# EAGLE design antares-O (EAGLE 4.16)
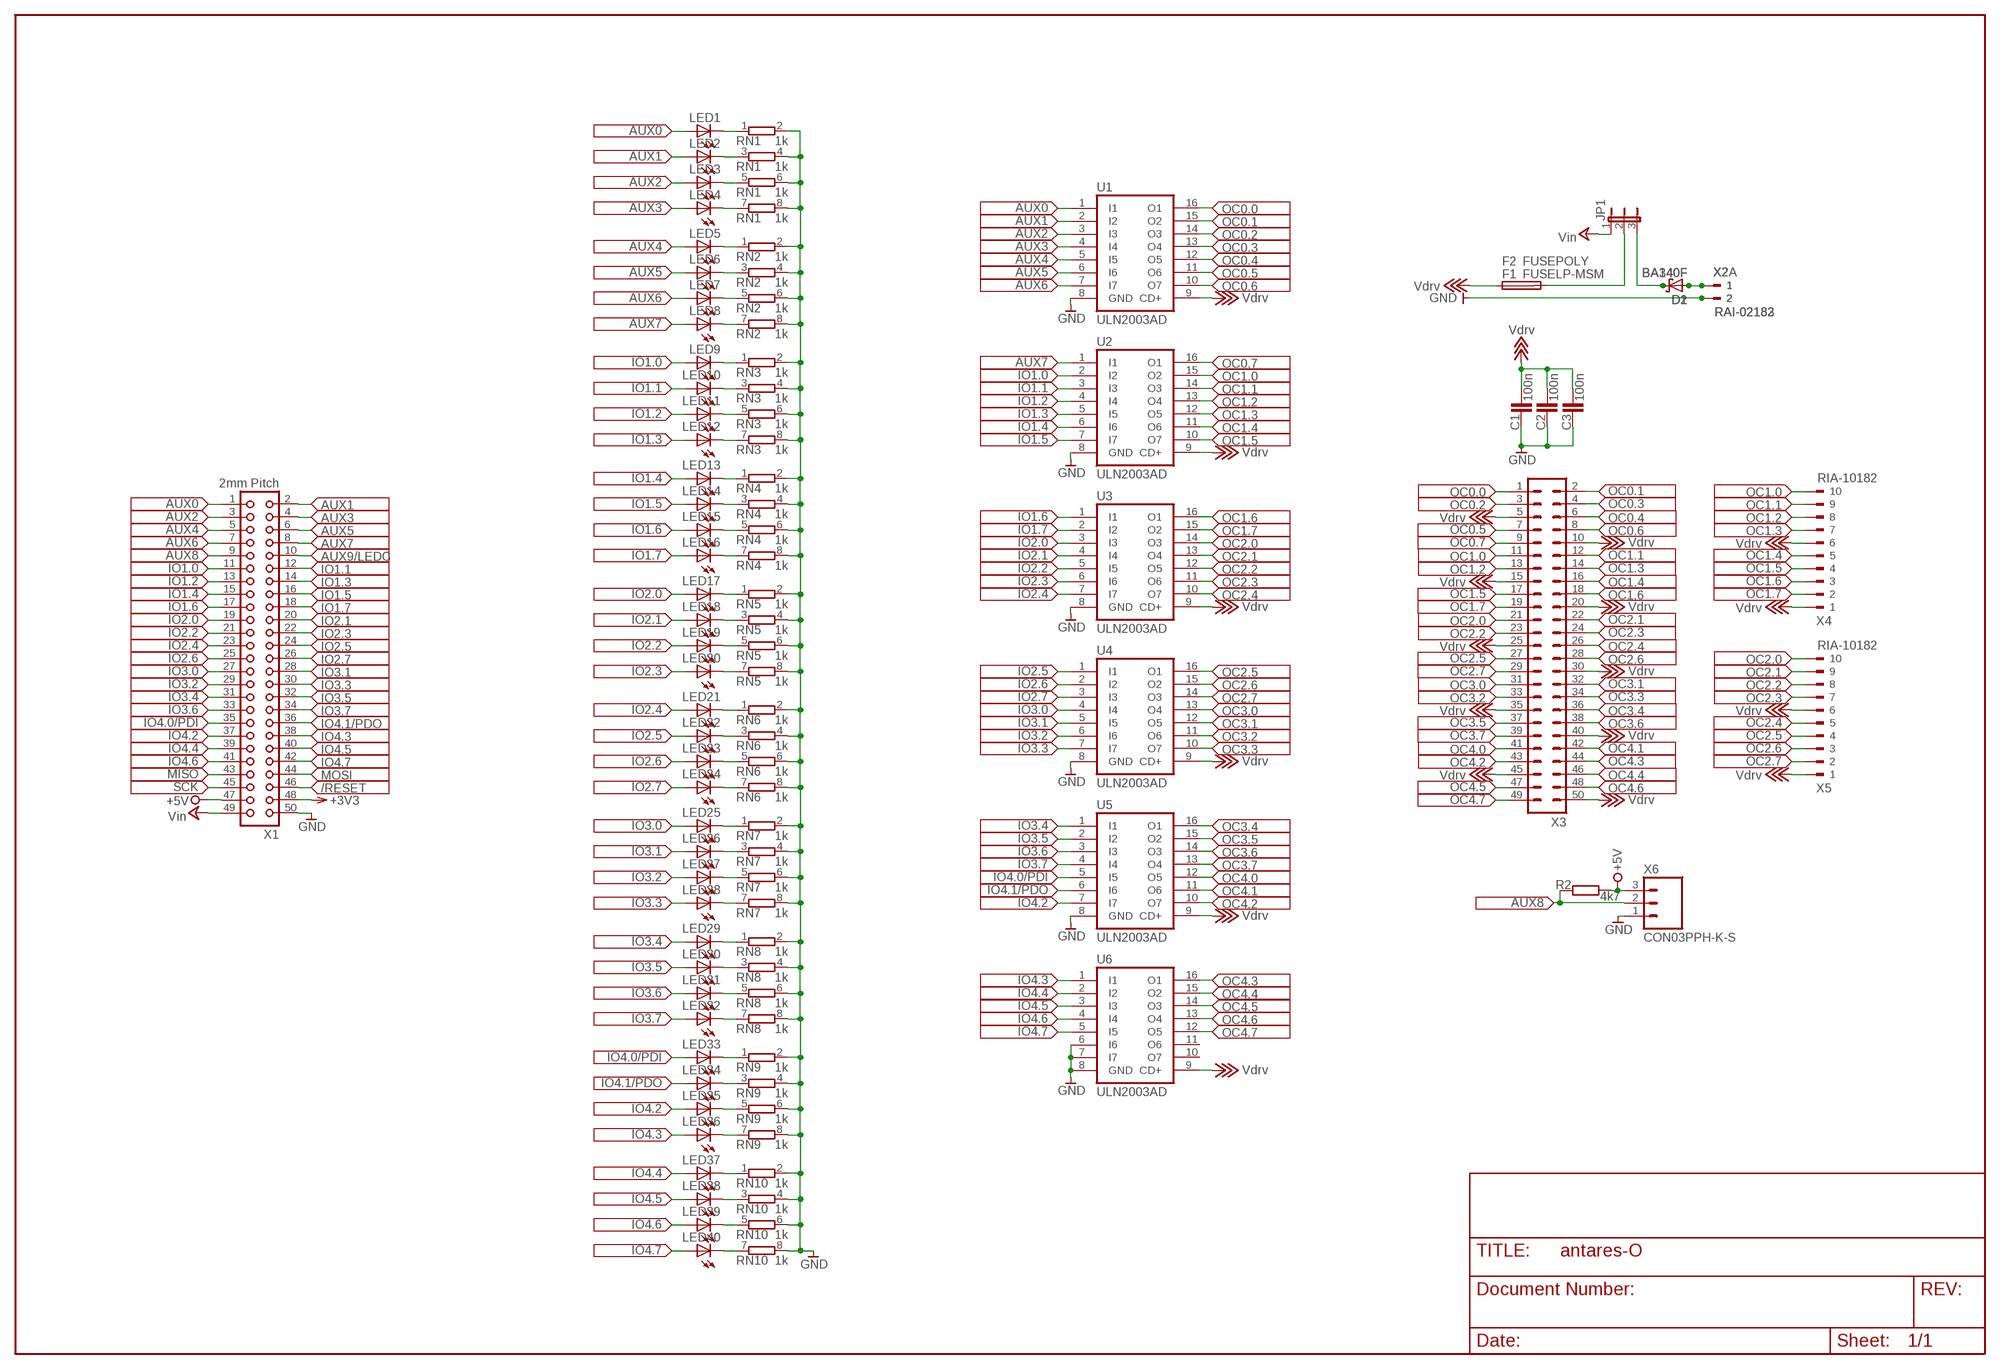
[diagram p0: schematic, sheet 1]

## Parts
C1  100n  C-EUC1206  [C1206]
C2  100n  C-EUC1206  [C1206]
C3  100n  C-EUC1206  [C1206]
D1  BA140F  SCHOTTKY-DIODESMC  [SMC]
D2  BA340F  SCHOTTKY-DIODESMA  [SMA]
F1  FUSELP-MSM  [LP-MSM]
F2  FUSEPOLY  [POLYFUSE]
JP1  JP2EI  [JP2]
LED1  LEDCHIP-LED0805  [CHIP-LED0805]
LED2  LEDCHIP-LED0805  [CHIP-LED0805]
LED3  LEDCHIP-LED0805  [CHIP-LED0805]
LED4  LEDCHIP-LED0805  [CHIP-LED0805]
LED5  LEDCHIP-LED0805  [CHIP-LED0805]
LED6  LEDCHIP-LED0805  [CHIP-LED0805]
LED7  LEDCHIP-LED0805  [CHIP-LED0805]
LED8  LEDCHIP-LED0805  [CHIP-LED0805]
LED9  LEDCHIP-LED0805  [CHIP-LED0805]
LED10  LEDCHIP-LED0805  [CHIP-LED0805]
LED11  LEDCHIP-LED0805  [CHIP-LED0805]
LED12  LEDCHIP-LED0805  [CHIP-LED0805]
LED13  LEDCHIP-LED0805  [CHIP-LED0805]
LED14  LEDCHIP-LED0805  [CHIP-LED0805]
LED15  LEDCHIP-LED0805  [CHIP-LED0805]
LED16  LEDCHIP-LED0805  [CHIP-LED0805]
LED17  LEDCHIP-LED0805  [CHIP-LED0805]
LED18  LEDCHIP-LED0805  [CHIP-LED0805]
LED19  LEDCHIP-LED0805  [CHIP-LED0805]
LED20  LEDCHIP-LED0805  [CHIP-LED0805]
LED21  LEDCHIP-LED0805  [CHIP-LED0805]
LED22  LEDCHIP-LED0805  [CHIP-LED0805]
LED23  LEDCHIP-LED0805  [CHIP-LED0805]
LED24  LEDCHIP-LED0805  [CHIP-LED0805]
LED25  LEDCHIP-LED0805  [CHIP-LED0805]
LED26  LEDCHIP-LED0805  [CHIP-LED0805]
LED27  LEDCHIP-LED0805  [CHIP-LED0805]
LED28  LEDCHIP-LED0805  [CHIP-LED0805]
LED29  LEDCHIP-LED0805  [CHIP-LED0805]
LED30  LEDCHIP-LED0805  [CHIP-LED0805]
LED31  LEDCHIP-LED0805  [CHIP-LED0805]
LED32  LEDCHIP-LED0805  [CHIP-LED0805]
LED33  LEDCHIP-LED0805  [CHIP-LED0805]
LED34  LEDCHIP-LED0805  [CHIP-LED0805]
LED35  LEDCHIP-LED0805  [CHIP-LED0805]
LED36  LEDCHIP-LED0805  [CHIP-LED0805]
LED37  LEDCHIP-LED0805  [CHIP-LED0805]
LED38  LEDCHIP-LED0805  [CHIP-LED0805]
LED39  LEDCHIP-LED0805  [CHIP-LED0805]
LED40  LEDCHIP-LED0805  [CHIP-LED0805]
R2  4k7  R-EU_R0603  [R0603]
RN1  1k  E4RP  [BCN16]
RN2  1k  E4RP  [BCN16]
RN3  1k  E4RP  [BCN16]
RN4  1k  E4RP  [BCN16]
RN5  1k  E4RP  [BCN16]
RN6  1k  E4RP  [BCN16]
RN7  1k  E4RP  [BCN16]
RN8  1k  E4RP  [BCN16]
RN9  1k  E4RP  [BCN16]
RN10  1k  E4RP  [BCN16]
U1  ULN2003AD  [SO16]
U2  ULN2003AD  [SO16]
U3  ULN2003AD  [SO16]
U4  ULN2003AD  [SO16]
U5  ULN2003AD  [SO16]
U6  ULN2003AD  [SO16]
X1  2mm Pitch  CON50M  [2MM-50DM]
X2  RAI-02182  [182-02]
X2A  RAI-02183  [183-02]
X3  ML50  [ML50]
X4  RIA-10182  [182-10]
X5  RIA-10182  [182-10]
X6  CON03PPH-K-S  [B3B-PH-K-S]

## Nets
+3V3: X1.48
+5V: R2.2 X1.47 X6.3
/RESET: X1.46
AUX0: LED1.A U1.1(I1) X1.1
AUX1: LED2.A U1.2(I2) X1.2
AUX2: LED3.A U1.3(I3) X1.3
AUX3: LED4.A U1.4(I4) X1.4
AUX4: LED5.A U1.5(I5) X1.5
AUX5: LED6.A U1.6(I6) X1.6
AUX6: LED7.A U1.7(I7) X1.7
AUX7: LED8.A U2.1(I1) X1.8
AUX8: R2.1 X1.9 X6.2
AUX9: X1.10
GND [gnd-vcc]: C1.1 C2.1 C3.1 RN1.2 RN1.4 RN1.6 RN1.8 RN2.2 RN2.4 RN2.6 RN2.8 RN3.2 RN3.4 RN3.6 RN3.8 RN4.2 RN4.4 RN4.6 RN4.8 RN5.2 RN5.4 RN5.6 RN5.8 RN6.2 RN6.4 RN6.6 RN6.8 RN7.2 RN7.4 RN7.6 RN7.8 RN8.2 RN8.4 RN8.6 RN8.8 RN9.2 RN9.4 RN9.6 RN9.8 RN10.2 RN10.4 RN10.6 RN10.8 U1.8(GND) U2.8(GND) U3.8(GND) U4.8(GND) U5.8(GND) U6.6(I6) U6.7(I7) U6.8(GND) X1.50 X2.2 X2A.2 X6.1
IO1.0: LED9.A U2.2(I2) X1.11
IO1.1: LED10.A U2.3(I3) X1.12
IO1.2: LED11.A U2.4(I4) X1.13
IO1.3: LED12.A U2.5(I5) X1.14
IO1.4: LED13.A U2.6(I6) X1.15
IO1.5: LED14.A U2.7(I7) X1.16
IO1.6: LED15.A U3.1(I1) X1.17
IO1.7: LED16.A U3.2(I2) X1.18
IO2.0: LED17.A U3.3(I3) X1.19
IO2.1: LED18.A U3.4(I4) X1.20
IO2.2: LED19.A U3.5(I5) X1.21
IO2.3: LED20.A U3.6(I6) X1.22
IO2.4: LED21.A U3.7(I7) X1.23
IO2.5: LED22.A U4.1(I1) X1.24
IO2.6: LED23.A U4.2(I2) X1.25
IO2.7: LED24.A U4.3(I3) X1.26
IO3.0: LED25.A U4.4(I4) X1.27
IO3.1: LED26.A U4.5(I5) X1.28
IO3.2: LED27.A U4.6(I6) X1.29
IO3.3: LED28.A U4.7(I7) X1.30
IO3.4: LED29.A U5.1(I1) X1.31
IO3.5: LED30.A U5.2(I2) X1.32
IO3.6: LED31.A U5.3(I3) X1.33
IO3.7: LED32.A U5.4(I4) X1.34
IO4.0: LED33.A U5.5(I5) X1.35
IO4.1: LED34.A U5.6(I6) X1.36
IO4.2: LED35.A U5.7(I7) X1.37
IO4.3: LED36.A U6.1(I1) X1.38
IO4.4: LED37.A U6.2(I2) X1.39
IO4.5: LED38.A U6.3(I3) X1.40
IO4.6: LED39.A U6.4(I4) X1.41
IO4.7: LED40.A U6.5(I5) X1.42
MISO: X1.43
MOSI: X1.44
N$1 [power]: D1.A D2.A X2.1 X2A.1
N$2: D1.C D2.C JP1.3
N$3: LED1.C RN1.1
N$4: LED2.C RN1.3
N$5: LED3.C RN1.5
N$6: LED4.C RN1.7
N$7: LED5.C RN2.1
N$8: LED6.C RN2.3
N$9: LED7.C RN2.5
N$10: LED8.C RN2.7
N$11: LED9.C RN3.1
N$12: LED10.C RN3.3
N$13: LED11.C RN3.5
N$14: LED12.C RN3.7
N$15: LED13.C RN4.1
N$16: LED14.C RN4.3
N$17: LED15.C RN4.5
N$18: LED16.C RN4.7
N$19: LED17.C RN5.1
N$20: LED18.C RN5.3
N$21: LED19.C RN5.5
N$22: LED20.C RN5.7
N$23: LED21.C RN6.1
N$24: LED22.C RN6.3
N$25: LED23.C RN6.5
N$26: LED24.C RN6.7
N$27: LED25.C RN7.1
N$28: LED26.C RN7.3
N$29: LED27.C RN7.5
N$30: LED28.C RN7.7
N$31: LED29.C RN8.1
N$32: LED30.C RN8.3
N$33: LED31.C RN8.5
N$34: LED32.C RN8.7
N$35: LED33.C RN9.1
N$36: LED34.C RN9.3
N$37: LED35.C RN9.5
N$38: LED36.C RN9.7
N$39: LED37.C RN10.1
N$40: LED38.C RN10.3
N$41: LED39.C RN10.5
N$42: LED40.C RN10.7
OC0.0: U1.16(O1) X3.1
OC0.1: U1.15(O2) X3.2
OC0.2: U1.14(O3) X3.3
OC0.3: U1.13(O4) X3.4
OC0.4: U1.12(O5) X3.6
OC0.5: U1.11(O6) X3.7
OC0.6: U1.10(O7) X3.8
OC0.7: U2.16(O1) X3.9
OC1.0: U2.15(O2) X3.11 X4.10
OC1.1: U2.14(O3) X3.12 X4.9
OC1.2: U2.13(O4) X3.13 X4.8
OC1.3: U2.12(O5) X3.14 X4.7
OC1.4: U2.11(O6) X3.16 X4.5
OC1.5: U2.10(O7) X3.17 X4.4
OC1.6: U3.16(O1) X3.18 X4.3
OC1.7: U3.15(O2) X3.19 X4.2
OC2.0: U3.14(O3) X3.21 X5.10
OC2.1: U3.13(O4) X3.22 X5.9
OC2.2: U3.12(O5) X3.23 X5.8
OC2.3: U3.11(O6) X3.24 X5.7
OC2.4: U3.10(O7) X3.26 X5.5
OC2.5: U4.16(O1) X3.27 X5.4
OC2.6: U4.15(O2) X3.28 X5.3
OC2.7: U4.14(O3) X3.29 X5.2
OC3.0: U4.13(O4) X3.31
OC3.1: U4.12(O5) X3.32
OC3.2: U4.11(O6) X3.33
OC3.3: U4.10(O7) X3.34
OC3.4: U5.16(O1) X3.36
OC3.5: U5.15(O2) X3.37
OC3.6: U5.14(O3) X3.38
OC3.7: U5.13(O4) X3.39
OC4.0: U5.12(O5) X3.41
OC4.1: U5.11(O6) X3.42
OC4.2: U5.10(O7) X3.43
OC4.3: U6.16(O1) X3.44
OC4.4: U6.15(O2) X3.46
OC4.5: U6.14(O3) X3.47
OC4.6: U6.13(O4) X3.48
OC4.7: U6.12(O5) X3.49
SCK: X1.45
VDRV [power]: C1.2 C2.2 C3.2 F1.1 F2.1 U1.9(CD+) U2.9(CD+) U3.9(CD+) U4.9(CD+) U5.9(CD+) U6.9(CD+) X3.5 X3.10 X3.15 X3.20 X3.25 X3.30 X3.35 X3.40 X3.45 X3.50 X4.1 X4.6 X5.1 X5.6 ; supply symbol labelled Vdrv
VIN [power]: JP1.1 X1.49 ; supply symbol labelled Vin
VSUPP [power]: F1.2 F2.2 JP1.2
Unconnected: U6.10(O7) U6.11(O6)

## Library data of the parts
C1-C3 = rcl:C-EU: CAPACITOR, European symbol
D1 D2 = diode:SCHOTTKY-DIODE: Schottky Diode
F1 F2 = fuse:FUSE: Fuse
JP1 = jumper:JP2E: JUMPER
LED1-LED40 = led:LED: LED OSRAM: - CHIPLED LG R971, LG N971, LY N971, LG Q971, LY Q971, LO R971, LY R971 LH N974, LH R974 LS Q976, LO Q976, LY Q976 LO Q996 - Hyper CHIPLED LW Q18S LB Q993, LB Q99A, LB R99A - SideLED LS A670, LO A670, LY A670, LG A670, LP A670 LB A673, LV A673, LT A673, LW A673 LH A674 LY A675 LS A676, LA A676, LO A676, LY A676, LW A676 LS A679, LY A679, LG A679 - Hyper Micro SIDELED® LS Y876, LA Y876, LO Y876, LY Y876 LT Y87S - SmartLED LW L88C, LW L88S LB L89C, LB L89S, LG L890 LS L89K, LO L89K, LY L89K LS L896, LA L896, LO L896, LY L896 - TOPLED LS T670, LO T670, LY T670, LG T670, LP T670 LSG T670, LSP T670, LSY T670, LOP T670, LYG T670 LG T671, LOG T671, LSG T671 LB T673, LV T673, LT T673, LW T673 LH T674 LS T676, LA T676, LO T676, LY T676, LB T676, LH T676, LSB T676, LW T676 LB T67C, LV T67C, LT T67C, LS T67K, LO T67K, LY T67K, LW E67C LS E67B, LA E67B, LO E67B, LY E67B, LB E67C, LV E67C, LT E67C LW T67C LS T679, LY T679, LG T679 LS T770, LO T770, LY T770, LG T770, LP T770 LB T773, LV T773, LT T773, LW T773 LH T774 LS E675, LA E675, LY E675, LS T675 LS T776, LA T776, LO T776, LY T776, LB T776 LHGB T686 LT T68C, LB T68C - Hyper Mini TOPLED® LB M676 - Mini TOPLED Santana® LG M470 LS M47K, LO M47K, LY M47K Source: http://www.osram.convergy.de - LUMILED® LXK2-PW12-R00, LXK2-PW12-S00, LXK2-PW14-U00, LXK2-PW14-V00 LXK2-PM12-R00, LXK2-PM12-S00, LXK2-PM14-U00 LXK2-PE12-Q00, LXK2-PE12-R00, LXK2-PE12-S00, LXK2-PE14-T00, LXK2-PE14-U00 LXK2-PB12-K00, LXK2-PB12-L00, LXK2-PB12-M00, LXK2-PB14-N00, LXK2-PB14-P00, LXK2-PB14-Q00 LXK2-PR12-L00, LXK2-PR12-M00, LXK2-PR14-Q00, LXK2-PR14-R00 LXK2-PD12-Q00, LXK2-PD12-R00, LXK2-PD12-S00 LXK2-PH12-R00, LXK2-PH12-S00 LXK2-PL12-P00, LXK2-PL12-Q00, LXK2-PL12-R00 Source: www.luxeon.com
R2 = rcl:R-EU_: RESISTOR, European symbol
RN1-RN10 = _frank:E4RP: SIL RESISTOR
U1-U6 = uln-udn:ULN2003A: DRIVER ARRAY
X1 = con-2mm-dual:CON50: CONNECTOR
X2 X2A = con-ria:RAI-02
X3 = con-harting-ml:ML50: HARTING
X4 X5 = con-ria:RIA-10
X6 = _frank:CON03P

## Net classes
0 default: width 0.15 mm, drill 0.15 mm, clearance 0.3 mm
1 power: width 0.15 mm, drill 0.5 mm, clearance 0.3 mm
2 gnd-vcc: width 0.15 mm, drill 0.15 mm, clearance 0.3 mm

## Board
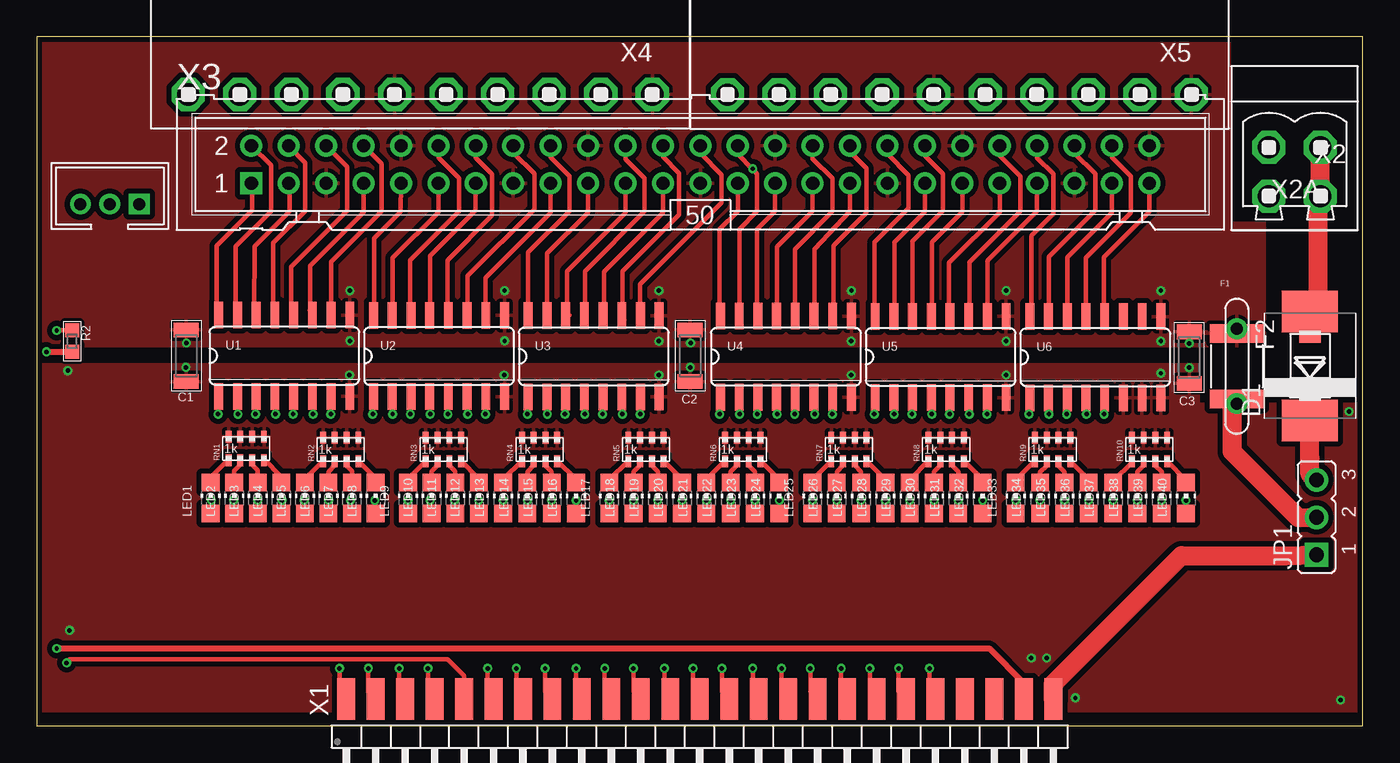
[diagram p1: board, top side]
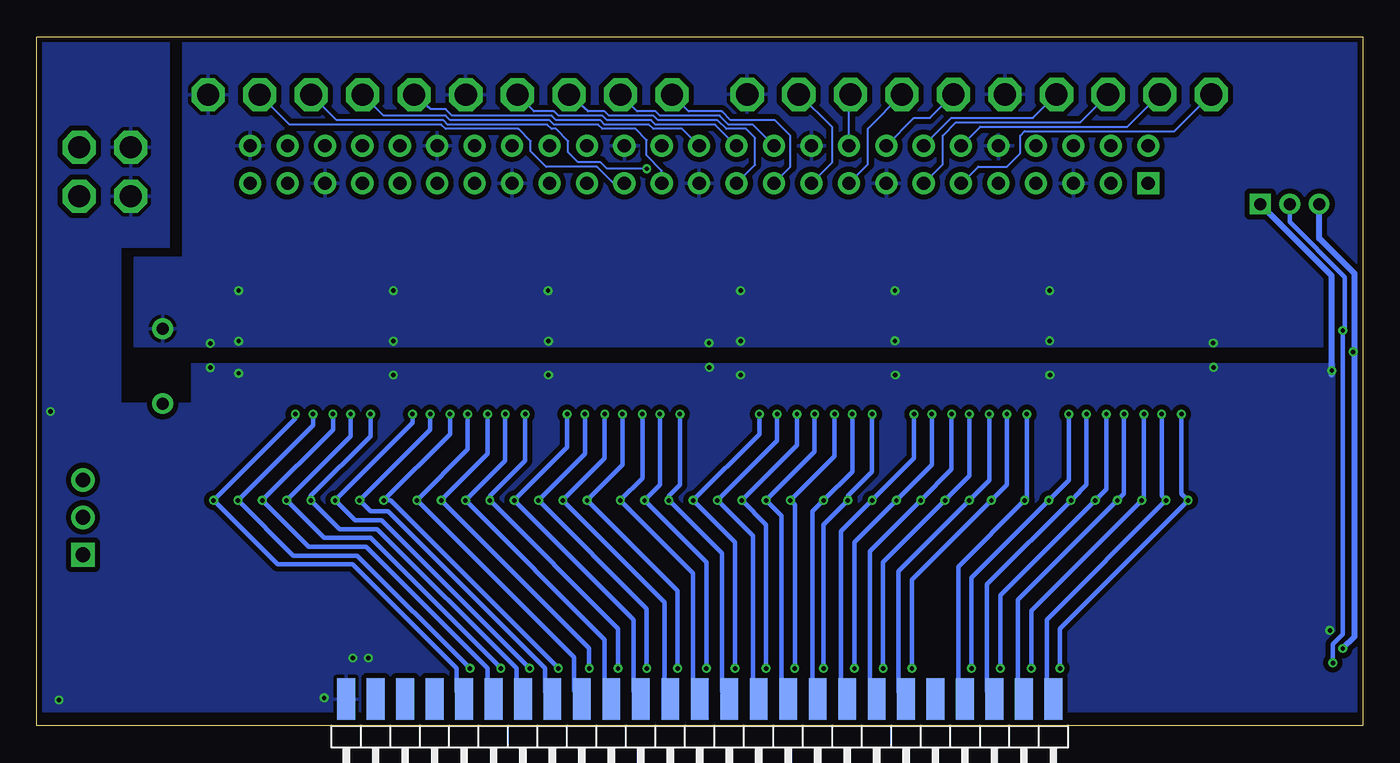
[diagram p2: board, bottom side, seen from below]

Size 90 x 46.75 mm. Coordinates in mm from the lower left corner, seen from the top.
Outline: 90,0 90,46.75 0,46.75 0,0 90,0
Copper layers (1*16): Top 0.035mm / dielectric 1.5mm / Bottom 0.035mm
Design rules "default": minimum track width 0.15mm, minimum drill 0.3mm, track to track 0.15mm, track to pad 0.15mm, pad to pad 0.15mm, via to via 0.15mm, smd to smd 0mil, copper to edge 0.35mm, drill to drill 8mil, minimum pad ring 0.15mm, minimum via ring 0.15mm, stop-mask expansion 0.15mm, vias tented up to drill 0.35mm, thermal gap 10mil

### Footprints (pad centres in the part's own frame; a part is rotated, then mirrored left to right if it is on the bottom)
C1206 = smd 1 x 1.7: 1 -1.75,0; 2 1.75,0
SMC = smd 2.8 x 3.8: A 3.7,0; C -3.7,0
SMA = smd 1.27 x 1.473: A 2.2,0; C -2.2,0
LP-MSM = smd 1.27 x 3.683: 1 -2.222,0; 2 2.223,0
POLYFUSE = drill 0.8 pad 1.4 round: 1 -2.54,0; 2 2.54,0
JP2 = drill 1 pad 1.6 square: 1 -2.54,0 | drill 1 pad 1.6 round: 2 0,0; 3 2.54,0
CHIP-LED0805 = smd 1.2 x 1.2: A 0,-1.05; C 0,1.05
R0603 = smd 0.95 x 0.95: 1 -0.725,0; 2 0.725,0
BCN16 = smd 0.4 x 0.8: 1 -1.2,-0.8; 2 -1.2,0.8; 3 -0.4,-0.8; 4 -0.4,0.8; 5 0.4,-0.8; 6 0.4,0.8; 7 1.2,-0.8; 8 1.2,0.8
SO16 = smd 0.6 x 1.8: 1 -4.445,-2.756; 2 -3.175,-2.756; 3 -1.905,-2.756; 4 -0.635,-2.756; 5 0.635,-2.756; 6 1.905,-2.756; 7 3.175,-2.756; 8 4.445,-2.756; 9 4.445,2.756; 10 3.175,2.756; 11 1.905,2.756; 12 0.635,2.756; 13 -0.635,2.756; 14 -1.905,2.756; 15 -3.175,2.756; 16 -4.445,2.756
2MM-50DM = smd 2.8 x 1.2: 1 3.3,24; 3 3.3,22; 5 3.3,20; 7 3.3,18; 9 3.3,16; 11 3.3,14; 13 3.3,12; 15 3.3,10; 17 3.3,8; 19 3.3,6; 21 3.3,4; 23 3.3,2; 25 3.3,0; 27 3.3,-2; 29 3.3,-4; 31 3.3,-6; 33 3.3,-8; 35 3.3,-10; 37 3.3,-12; 39 3.3,-14; 41 3.3,-16; 43 3.3,-18; 45 3.3,-20; 47 3.3,-22; 49 3.3,-24 | smd 2.8 x 1.2 bottom: 2 3.3,24; 4 3.3,22; 6 3.3,20; 8 3.3,18; 10 3.3,16; 12 3.3,14; 14 3.3,12; 16 3.3,10; 18 3.3,8; 20 3.3,6; 22 3.3,4; 24 3.3,2; 26 3.3,0; 28 3.3,-2; 30 3.3,-4; 32 3.3,-6; 34 3.3,-8; 36 3.3,-10; 38 3.3,-12; 40 3.3,-14; 42 3.3,-16; 44 3.3,-18; 46 3.3,-20; 48 3.3,-22; 50 3.3,-24
182-02 = drill 1.5 pad 2 octagon: 1 -1.75,0; 2 1.75,0
183-02 = drill 1.5 pad 2 octagon: 1 -1.75,0; 2 1.75,0
ML50 = drill 0.9 pad 1.5 square: 1 -30.48,-1.27 | drill 0.9 pad 1.5 round: 2 -30.48,1.27; 3 -27.94,-1.27; 4 -27.94,1.27; 5 -25.4,-1.27; 6 -25.4,1.27; 7 -22.86,-1.27; 8 -22.86,1.27; 9 -20.32,-1.27; 10 -20.32,1.27; 11 -17.78,-1.27; 12 -17.78,1.27; 13 -15.24,-1.27; 14 -15.24,1.27; 15 -12.7,-1.27; 16 -12.7,1.27; 17 -10.16,-1.27; 18 -10.16,1.27; 19 -7.62,-1.27; 20 -7.62,1.27; 21 -5.08,-1.27; 22 -5.08,1.27; 23 -2.54,-1.27; 24 -2.54,1.27; 25 0,-1.27; 26 0,1.27; 27 2.54,-1.27; 28 2.54,1.27; 29 5.08,-1.27; 30 5.08,1.27; 31 7.62,-1.27; 32 7.62,1.27; 33 10.16,-1.27; 34 10.16,1.27; 35 12.7,-1.27; 36 12.7,1.27; 37 15.24,-1.27; 38 15.24,1.27; 39 17.78,-1.27; 40 17.78,1.27; 41 20.32,-1.27; 42 20.32,1.27; 43 22.86,-1.27; 44 22.86,1.27; 45 25.4,-1.27; 46 25.4,1.27; 47 27.94,-1.27; 48 27.94,1.27; 49 30.48,-1.27; 50 30.48,1.27
182-10 = drill 1.5 pad 2 octagon: 1 -15.75,0; 2 -12.25,0; 3 -8.75,0; 4 -5.25,0; 5 -1.75,0; 6 1.75,0; 7 5.25,0; 8 8.75,0; 9 12.25,0; 10 15.75,0
B3B-PH-K-S = drill 0.8 pad 1.4 square: 1 0,-2 | drill 0.8 pad 1.4 round: 2 0,0; 3 0,2

### Placement (x,y rotation side)
C1  10.15,25.11 90 top
C2  44.35,25.11 90 top
C3  78.22,24.98 90 top
D1  86.42,24.42 90 top
D2  86.42,24.43 90 top
F1  81.46,24.4 270 top
F2  81.45,24.4 270 top
JP1  86.86,14.14 90 top
LED1  11.8,15.46 0 top
LED2  13.4,15.46 0 top
LED3  15,15.46 0 top
LED4  16.6,15.46 0 top
LED5  18.2,15.46 0 top
LED6  19.8,15.46 0 top
LED7  21.4,15.46 0 top
LED8  23,15.46 0 top
LED9  25.2,15.46 0 top
LED10  26.8,15.46 0 top
LED11  28.4,15.46 0 top
LED12  30,15.46 0 top
LED13  31.65,15.45 0 top
LED14  33.3,15.45 0 top
LED15  34.95,15.45 0 top
LED16  36.6,15.45 0 top
LED17  38.85,15.45 0 top
LED18  40.5,15.45 0 top
LED19  42.15,15.45 0 top
LED20  43.8,15.45 0 top
LED21  45.45,15.45 0 top
LED22  47.1,15.45 0 top
LED23  48.75,15.45 0 top
LED24  50.4,15.45 0 top
LED25  52.65,15.45 0 top
LED26  54.3,15.45 0 top
LED27  55.95,15.45 0 top
LED28  57.6,15.45 0 top
LED29  59.25,15.45 0 top
LED30  60.9,15.45 0 top
LED31  62.55,15.45 0 top
LED32  64.2,15.45 0 top
LED33  66.45,15.45 0 top
LED34  68.1,15.45 0 top
LED35  69.75,15.45 0 top
LED36  71.4,15.45 0 top
LED37  73.05,15.45 0 top
LED38  74.7,15.45 0 top
LED39  76.35,15.45 0 top
LED40  78,15.45 0 top
R2  2.4,26.1 270 top
RN1  14.21,18.81 0 top
RN2  20.62,18.75 0 top
RN3  27.6,18.75 0 top
RN4  34.12,18.75 0 top
RN5  41.35,18.75 0 top
RN6  47.92,18.75 0 top
RN7  55.12,18.75 0 top
RN8  61.73,18.75 0 top
RN9  68.95,18.75 0 top
RN10  75.53,18.75 0 top
U1  16.8,25.11 0 top
U2  27.3,25.09 0 top
U3  37.8,25.07 0 top
U4  50.85,25.05 0 top
U5  61.35,25.03 0 top
U6  71.85,25.01 0 top
X1  45,-1.49 90 top
X2  85.38,35.94 180 top
X2A  85.38,39.25 180 top
X3  45.04,38.09 0 top
X4  26.03,42.84 180 top
X5  62.63,42.83 180 top
X6  4.95,35.4 90 top

### Tracks (layer width: path | path; a pad name or v marks a point on that pad's centre or on a via)
+5V  (via drill 0.3, 0.3 pad 0.6)
  Top 0.4: X1.47 67,2.9 64.65,5.25 v1.35,5.25 | v0.65,25.38 R2.2
  Bottom 0.4: v1.35,5.25 0.55,6.05 0.55,25.27 v0.65,25.38 0.55,25.48 0.55,30.68 2.95,33.08 X6.3
AUX0  (via drill 0.3 pad 0.6)
  Top 0.15: X1.1 21,1.75 | 12.3,22.3 U1.1
  Top 0.3: LED1.A 11.85,14.46 v11.85,15.3 | v12.3,21.15 12.3,22.3 | X1.1 20.55,2.27 v20.55,3.9
  Bottom 0.3: v12.3,21.15 12.3,15.75 v11.85,15.3 20.55,6.6 v20.55,3.9
AUX1  (via drill 0.3 pad 0.6)
  Top 0.15: 13.65,22.33 U1.2
  Top 0.3: 13.4,14.38 LED2.A 13.35,14.46 v13.35,15.3 | v13.65,21.15 13.65,22.33
  Bottom 0.3: v13.65,21.15 13.65,15.6 v13.35,15.3 21.45,7.2 21.45,2.27 X1.2
AUX2  (via drill 0.3 pad 0.6)
  Top 0.15: 14.85,22.31 U1.3
  Top 0.3: 15,14.32 LED3.A v15,15.3 | v14.85,21.15 14.85,22.31 | X1.3 22.5,2.31 v22.5,3.9
  Bottom 0.3: v14.85,21.15 14.85,15.45 v15,15.3 22.5,7.8 v22.5,3.9
AUX3  (via drill 0.3 pad 0.6)
  Top 0.15: 16.2,22.32 U1.4
  Top 0.3: LED4.A 16.65,14.46 v16.65,15.3 | v16.2,21.15 16.2,22.32
  Bottom 0.3: v16.2,21.15 16.2,15.75 v16.65,15.3 23.4,8.55 23.4,2.21 X1.4
AUX4  (via drill 0.3 pad 0.6)
  Top 0.15: 17.4,22.32 U1.5
  Top 0.3: LED5.A 18.15,14.46 v18.15,15.3 | v17.4,21.15 17.4,22.32 | X1.5 24.6,2.21 v24.6,3.9
  Bottom 0.3: v17.4,21.15 17.4,16.05 v18.15,15.3 24.6,8.85 v24.6,3.9
AUX5  (via drill 0.3 pad 0.6)
  Top 0.15: 18.75,22.31 U1.6
  Top 0.3: v19.8,15.3 LED6.A | v18.75,21.15 18.75,22.31
  Bottom 0.3: 19.65,15.45 18.75,16.35 v18.75,21.15 | X1.6 25.5,2.31 25.5,9.6 19.65,15.45 | 19.65,15.45 v19.8,15.3
AUX6  (via drill 0.3 pad 0.6)
  Top 0.15: 19.95,22.33 U1.7
  Top 0.3: LED7.A 21.3,14.51 v21.3,15.3 | v19.95,21.15 19.95,22.33 | X1.7 26.55,2.27 v26.55,3.9
  Bottom 0.3: v19.95,21.15 19.95,16.65 v21.3,15.3 26.55,10.05 v26.55,3.9
AUX7  (via drill 0.3 pad 0.6)
  Top 0.15: 22.8,22.28 U2.1
  Top 0.3: LED8.A 22.95,14.46 v22.95,15.3 | v22.8,21.15 22.8,22.28
  Bottom 0.3: v22.8,21.15 22.8,15.45 v22.95,15.3 27.45,10.8 27.45,2.27 X1.8
AUX8  (via drill 0.3, 0.3 pad 0.6)
  Top 0.3: v1.35,26.82 R2.1 | X1.9 29,3.4 27.9,4.5 2.23,4.5 v2.02,4.28
  Bottom 0.15: v1.35,26.82 1.2,26.98
  Bottom 0.3: X6.2 4.95,34.2 1.2,30.45 1.2,26.98 | v1.35,26.82 1.35,6.2 2.02,5.53 v2.02,4.28
GND  (via drill 0.3, 0.3 pad 0.6)
  Bottom 0.4: 2.1,23.85 2.1,30.55 X6.1
  other vias: 70.5,1.9 68.55,4.6 67.5,4.6 76.3,23.93 65.8,23.8 55.27,23.8 42.23,23.8 31.73,23.8 21.23,23.8 2.23,6.47 2.1,24.1 88.5,1.75 10.12,24.32 44.35,24.32 78.22,24.3 89.08,21.32
  pour Bottom (isolate 0.35, rank 2): 90,46.75 90,1 0,1 0,24.55 79.5,24.55 79.5,21.85 84.3,21.85 84.3,32.5 81,32.5 81,46.75
  pour Top (isolate 0.35, rank 2): 90,1 90,21.85 78.9,21.85 78.9,24.55 0,24.55 0,1
IO1.0  (via drill 0.3 pad 0.6)
  Top 0.15: 24.15,22.31 U2.2
  Top 0.3: v25.2,15.3 LED9.A | v24.15,21.15 24.15,22.31 | X1.11 30.6,2.21 v30.6,3.9
  Bottom 0.3: v24.15,21.15 24.15,16.35 v25.2,15.3 30.6,9.9 v30.6,3.9
IO1.1  (via drill 0.3 pad 0.6)
  Top 0.15: 25.35,22.29 U2.3
  Top 0.3: LED10.A 26.7,14.51 v26.7,15.3 | v25.35,21.15 25.35,22.29
  Bottom 0.3: v25.35,21.15 25.35,16.65 v26.7,15.3 31.5,10.5 31.5,2.31 X1.12
IO1.2  (via drill 0.3 pad 0.6)
  Top 0.15: 26.7,22.3 U2.4
  Top 0.3: LED11.A 28.35,14.46 v28.35,15.3 | v26.7,21.15 26.7,22.3 | X1.13 32.55,2.27 v32.55,3.9
  Bottom 0.3: v26.7,21.15 26.7,16.95 v28.35,15.3 32.55,11.1 v32.55,3.9
IO1.3  (via drill 0.3 pad 0.6)
  Top 0.15: 27.9,22.3 U2.5
  Top 0.3: v30,15.3 LED12.A | v27.9,21.15 27.9,22.3
  Bottom 0.3: v27.9,21.15 27.9,17.4 v30,15.3 33.45,11.85 33.45,2.27 X1.14
IO1.4  (via drill 0.3 pad 0.6)
  Top 0.15: 29.25,22.29 U2.6
  Top 0.3: v31.65,15.3 LED13.A | v29.25,21.15 29.25,22.29 | X1.15 34.5,2.31 v34.5,3.9
  Bottom 0.3: v29.25,21.15 29.25,17.7 v31.65,15.3 34.5,12.45 v34.5,3.9
IO1.5  (via drill 0.3 pad 0.6)
  Top 0.15: 30.45,22.31 U2.7
  Top 0.3: v33.3,15.3 LED14.A | v30.45,21.15 30.45,22.31
  Bottom 0.3: v30.45,21.15 30.45,18.15 v33.3,15.3 35.4,13.2 35.4,2.21 X1.16
IO1.6  (via drill 0.3 pad 0.6)
  Top 0.15: 33.3,22.26 U3.1
  Top 0.3: v34.95,15.3 LED15.A | v33.3,21.15 33.3,22.26 | X1.17 36.6,2.21 v36.6,3.9
  Bottom 0.3: v33.3,21.15 33.3,17.25 34.95,15.6 v34.95,15.3 36.6,13.65 v36.6,3.9
IO1.7  (via drill 0.3 pad 0.6)
  Top 0.15: 34.65,22.29 U3.2
  Top 0.3: v36.6,15.3 LED16.A | v34.65,21.15 34.65,22.29
  Bottom 0.3: v34.65,21.15 34.65,17.25 v36.6,15.3 37.35,14.55 37.35,2.17 X1.18
IO2.0  (via drill 0.3 pad 0.6)
  Top 0.15: 35.85,22.27 U3.3
  Top 0.3: v38.85,15.3 LED17.A | v35.85,21.15 35.85,22.27 | X1.19 38.55,2.27 v38.55,3.9
  Bottom 0.3: v35.85,21.15 35.85,18.3 v38.85,15.3 38.55,15 v38.55,3.9
IO2.1  (via drill 0.3 pad 0.6)
  Top 0.15: 37.2,22.28 U3.4
  Top 0.3: v40.5,15.3 LED18.A | v37.2,21.15 37.2,22.28
  Bottom 0.3: v37.2,21.15 37.2,18.6 v40.5,15.3 39.45,14.25 39.45,2.27 X1.20
IO2.2  (via drill 0.3 pad 0.6)
  Top 0.15: 38.4,22.28 U3.5
  Top 0.3: v42.15,15.3 LED19.A | v38.4,21.15 38.4,22.28 | X1.21 40.5,2.31 v40.5,3.9
  Bottom 0.3: v38.4,21.15 38.4,19.05 v42.15,15.3 40.5,13.65 v40.5,3.9
IO2.3  (via drill 0.3 pad 0.6)
  Top 0.15: 39.75,22.27 U3.6
  Top 0.3: v43.8,15.3 LED20.A | v39.75,21.15 39.75,22.27
  Bottom 0.3: v39.75,21.15 39.75,19.35 v43.8,15.3 41.4,12.9 41.4,2.21 X1.22
IO2.4  (via drill 0.3 pad 0.6)
  Top 0.15: 40.98,22.6 U3.7 40.95,22.29
  Top 0.3: v45.45,15.3 LED21.A | v40.95,21.15 40.95,22.29 | X1.23 42.6,2.21 v42.6,3.9
  Bottom 0.3: v40.95,21.15 40.95,19.8 v45.45,15.3 42.6,12.45 v42.6,3.9
IO2.5  (via drill 0.3 pad 0.6)
  Top 0.15: 46.35,22.24 U4.1
  Top 0.3: v47.1,15.3 LED22.A | v46.35,21.15 46.35,22.24
  Bottom 0.3: v46.35,21.15 46.35,16.35 47.1,15.6 v47.1,15.3 43.5,11.7 43.5,2.31 X1.24
IO2.6  (via drill 0.3 pad 0.6)
  Top 0.15: 47.7,22.27 U4.2
  Top 0.3: v48.75,15.3 LED23.A | v47.7,21.15 47.7,22.27 | X1.25 44.55,2.27 v44.55,3.9
  Bottom 0.3: v47.7,21.15 47.7,16.35 v48.75,15.3 44.55,11.1 v44.55,3.9
IO2.7  (via drill 0.3 pad 0.6)
  Top 0.15: 48.9,22.25 U4.3
  Top 0.3: v50.4,15.3 LED24.A | v48.9,21.15 48.9,22.25
  Bottom 0.3: v48.9,21.15 48.9,16.8 v50.4,15.3 45.45,10.35 45.45,2.27 X1.26
IO3.0  (via drill 0.3 pad 0.6)
  Top 0.15: 50.25,22.26 U4.4
  Top 0.3: v52.65,15.3 LED25.A | v50.25,21.15 50.25,22.26 | X1.27 46.5,2.31 v46.5,3.9
  Bottom 0.3: v50.25,21.15 50.25,17.7 v52.65,15.3 46.5,9.15 v46.5,3.9
IO3.1  (via drill 0.3 pad 0.6)
  Top 0.15: 51.45,22.26 U4.5
  Top 0.3: v54.3,15.3 LED26.A | v51.45,21.15 51.45,22.26
  Bottom 0.3: v51.45,21.15 51.45,18.15 v54.3,15.3 47.4,8.4 47.4,2.21 X1.28
IO3.2  (via drill 0.3 pad 0.6)
  Top 0.15: 52.8,22.25 U4.6
  Top 0.3: v55.95,15.3 LED27.A | v52.8,21.15 52.8,22.25 | X1.29 48.6,2.21 v48.6,3.9
  Bottom 0.3: v52.8,21.15 52.8,18.45 v55.95,15.3 48.6,7.95 v48.6,3.9
IO3.3  (via drill 0.3 pad 0.6)
  Top 0.15: 54,22.27 U4.7
  Top 0.3: v57.6,15.3 LED28.A | v54,21.15 54,22.27
  Bottom 0.3: v54,21.15 54,18.9 v57.6,15.3 49.5,7.2 49.5,2.31 X1.30
IO3.4  (via drill 0.3 pad 0.6)
  Top 0.15: 56.85,22.22 U5.1
  Top 0.3: v59.25,15.3 LED29.A | v56.85,21.15 56.85,22.22 | X1.31 50.55,2.27 v50.55,3.9
  Bottom 0.3: v56.85,21.15 56.85,18 59.25,15.6 v59.25,15.3 50.55,6.6 v50.55,3.9
IO3.5  (via drill 0.3 pad 0.6)
  Top 0.15: 58.2,22.25 U5.2
  Top 0.3: v60.9,15.3 LED30.A | v58.2,21.15 58.2,22.25
  Bottom 0.3: v58.2,21.15 58.2,18 v60.9,15.3 51.45,5.85 51.45,2.27 X1.32
IO3.6  (via drill 0.3 pad 0.6)
  Top 0.15: 59.4,22.23 U5.3
  Top 0.3: v62.55,15.3 LED31.A | v59.4,21.15 59.4,22.23 | X1.33 52.5,2.31 v52.5,3.9
  Bottom 0.3: v59.4,21.15 59.4,18.45 v62.55,15.3 52.5,5.25 v52.5,3.9
IO3.7  (via drill 0.3 pad 0.6)
  Top 0.15: 60.75,22.24 U5.4
  Top 0.3: v64.2,15.3 LED32.A | v60.75,21.15 60.75,22.24
  Bottom 0.3: v60.75,21.15 60.75,18.75 v64.2,15.3 53.55,4.65 53.55,2.37 X1.34
IO4.0  (via drill 0.3 pad 0.6)
  Top 0.3: v66.45,15.3 LED33.A | U5.5 61.95,22.24 v61.95,21.15 | X1.35 54.6,2.21 v54.6,3.9
  Bottom 0.3: v61.95,21.15 61.95,19.8 v66.45,15.3 66,15.3 v54.6,3.9
IO4.1  (via drill 0.3 pad 0.6)
  Top 0.3: v68.1,15.3 LED34.A | U5.6 63.3,22.23 v63.3,21.15
  Bottom 0.3: v63.3,21.15 63.3,20.1 v68.1,15.3 67.35,14.55 66.15,14.55 55.5,3.9 55.5,2.31 X1.36
IO4.2  (via drill 0.3 pad 0.6)
  Top 0.3: v69.75,15.3 LED35.A | U5.7 64.5,22.25 v64.5,21.15 | X1.37 56.55,2.27 v56.55,3.9
  Bottom 0.3: v64.5,21.15 64.5,20.55 v69.75,15.3 68.4,13.95 66.6,13.95 v56.55,3.9
IO4.3  (via drill 0.3 pad 0.6)
  Top 0.3: v71.4,15.3 LED36.A | U6.1 67.35,22.2 v67.35,21.15
  Bottom 0.3: v67.35,21.15 67.35,19.65 71.4,15.6 v71.4,15.3 69.45,13.35 66.9,13.35 57.45,3.9 57.45,2.27 X1.38
IO4.4  (via drill 0.3 pad 0.6)
  Top 0.3: v73.05,15.3 LED37.A | U6.2 68.7,22.23 v68.7,21.15 | X1.39 58.5,2.31 v58.5,3.9
  Bottom 0.3: v68.7,21.15 68.7,19.65 v73.05,15.3 70.5,12.75 67.35,12.75 v58.5,3.9
IO4.5  (via drill 0.3 pad 0.6)
  Top 0.3: v74.7,15.3 LED38.A | U6.3 69.9,22.21 v69.9,21.15
  Bottom 0.3: v69.9,21.15 69.9,20.1 v74.7,15.3 71.55,12.15 67.65,12.15 59.4,3.9 59.4,2.21 X1.40
IO4.6  (via drill 0.3 pad 0.6)
  Top 0.3: v76.35,15.3 LED39.A | U6.4 71.25,22.22 v71.25,21.15 | X1.41 60.6,2.21 v60.6,3.9
  Bottom 0.3: v71.25,21.15 71.25,20.4 v76.35,15.3 72.6,11.55 68.25,11.55 v60.6,3.9
IO4.7  (via drill 0.3 pad 0.6)
  Top 0.3: v78,15.3 LED40.A | U6.5 72.45,22.22 v72.45,21.15
  Bottom 0.3: v72.45,21.15 72.45,20.85 v78,15.3 73.65,10.95 68.55,10.95 61.5,3.9 61.5,2.31 X1.42
N$1
  Top 1.3: D2.A 86.42,28.02 86.4,28.05 86.42,28.07 D1.A 86.42,28.2 87,28.77 87,35.94 X2.1 X2A.1
N$2
  Top 1.3: JP1.3 86.42,17.09 86.4,17.7 86.42,18.17 D1.C | D1.C 86.4,20.7 | D2.C D1.C
N$3
  Top 0.3: RN1.1 13.02,18.09 11.8,16.88 LED1.C
N$4
  Top 0.3: RN1.3 13.81,17.71 13.4,17.3 LED2.C
N$5
  Top 0.3: RN1.5 14.62,17.71 15,17.32 LED3.C
N$6
  Top 0.3: RN1.7 15.41,18.09 16.6,16.9 LED4.C
N$7
  Top 0.3: RN2.1 19.43,17.98 18.2,16.75 LED5.C
N$8
  Top 0.3: RN2.3 20.23,17.68 19.8,17.25 LED6.C
N$9
  Top 0.3: RN2.5 21.02,17.65 21.4,17.27 LED7.C
N$10
  Top 0.3: RN2.7 21.82,17.98 23,16.8 LED8.C
N$11
  Top 0.3: LED9.C 25.2,16.75 RN3.1
N$12
  Top 0.3: RN3.3 27.2,17.68 26.8,17.27 LED10.C
N$13
  Top 0.3: RN3.5 28,17.68 28.4,17.27 LED11.C
N$14
  Top 0.3: RN3.7 28.8,17.98 30,16.77 LED12.C
N$15
  Top 0.3: RN4.1 32.92,18 31.65,16.73 LED13.C
N$16
  Top 0.3: RN4.3 33.73,17.68 33.3,17.25 LED14.C
N$17
  Top 0.3: RN4.5 34.52,17.65 34.95,17.23 LED15.C
N$18
  Top 0.3: RN4.7 35.33,18 36.6,16.73 LED16.C
N$19
  Top 0.3: RN5.1 40.15,18 38.85,16.7 LED17.C
N$20
  Top 0.3: RN5.3 40.95,17.68 40.5,17.23 LED18.C
N$21
  Top 0.3: RN5.5 41.75,17.65 42.15,17.25 LED19.C
N$22
  Top 0.3: RN5.7 42.55,17.98 43.8,16.73 LED20.C
N$23
  Top 0.3: RN6.1 46.73,18 45.45,16.73 LED21.C
N$24
  Top 0.3: RN6.3 47.52,17.68 47.1,17.25 LED22.C
N$25
  Top 0.3: RN6.5 48.33,17.65 48.75,17.23 LED23.C
N$26
  Top 0.3: RN6.7 49.12,17.98 50.4,16.7 LED24.C
N$27
  Top 0.3: RN7.1 53.92,17.98 52.65,16.7 LED25.C
N$28
  Top 0.3: RN7.3 54.73,17.68 54.3,17.25 LED26.C
N$29
  Top 0.3: RN7.5 55.52,17.68 55.95,17.25 LED27.C
N$30
  Top 0.3: RN7.7 56.33,17.98 57.6,16.7 LED28.C
N$31
  Top 0.3: RN8.1 60.52,17.98 59.25,16.7 LED29.C
N$32
  Top 0.3: RN8.3 61.33,17.68 60.9,17.25 LED30.C
N$33
  Top 0.3: RN8.5 62.12,17.68 62.55,17.25 LED31.C
N$34
  Top 0.3: RN8.7 62.92,18 64.2,16.73 LED32.C
N$35
  Top 0.3: RN9.1 67.75,18 66.45,16.7 LED33.C
N$36
  Top 0.3: RN9.3 68.55,17.65 68.1,17.2 LED34.C
N$37
  Top 0.3: RN9.5 69.35,17.65 69.75,17.25 LED35.C
N$38
  Top 0.3: LED36.C 71.4,16.7 RN9.7
N$39
  Top 0.3: RN10.1 74.33,17.85 73.12,16.65 LED37.C
N$40
  Top 0.3: RN10.3 75.12,17.65 74.7,17.23 LED38.C
N$41
  Top 0.3: RN10.5 75.92,17.65 76.35,17.23 LED39.C
N$42
  Top 0.3: LED40.C 78,16.68 RN10.7
OC0.0
  Top 0.3: 12.2,28.18 | U1.16 12.2,28.18 | X3.1 14.6,36.78 14.6,34.98 12.2,32.58 12.2,28.18
OC0.1
  Top 0.3: X3.2 15.9,38.02 15.9,34.92 13.5,32.52 13.5,28.16 | 13.5,28.16 13.5,28.15 | U1.15 13.5,28.16
OC0.2
  Top 0.3: 14.75,28.18 | U1.14 14.75,28.18 | X3.3 17.15,36.77 17.15,34.9 14.8,32.55 14.75,28.18
OC0.3
  Top 0.3: 16.02,28.17 16.02,28.15 | U1.13 16.02,28.17 | X3.4 18.23,38.21 18.23,34.92 16.02,32.77 16.02,28.17
OC0.4
  Top 0.3: X3.6 21.05,37.95 21.05,34.95 17.25,31.15 17.25,28.15 U1.12
OC0.5
  Top 0.3: X3.7 22.18,34.85 18.55,31.23 18.55,28.23 18.52,28.2 18.54,28.18 U1.11
OC0.6
  Top 0.3: X3.8 23.4,38.14 23.4,34.9 19.98,31.48 U1.10 19.82,28.18
OC0.7
  Top 0.3: U2.16 22.89,28.27 22.9,33.08 24.7,34.89 X3.9
OC1.0
  Top 0.3: X3.11 27.26,34.86 24.15,31.75 24.15,28.15 24.16,28.16 U2.15
  Bottom 0.15: X4.10 12.77,40.35 22.95,40.35 23.25,40.05 23.25,38.85 24.15,37.95 26.1,37.95 27.15,36.9 27.18,36.9 X3.11
OC1.1
  Top 0.3: X3.12 27.26,38.54 28.65,37.15 28.65,34.9 25.35,31.6 25.35,28 25.36,28.16 | 25.36,28.16 25.35,28.15 | U2.14 25.36,28.16
  Bottom 0.15: X4.9 15.97,40.65 25.95,40.65 27.15,39.45 27.17,39.45 X3.12
OC1.2
  Top 0.3: X3.13 29.8,35 26.7,31.9 26.7,28.15 26.71,28.16 U2.13
  Bottom 0.15: X4.8 19.17,40.95 27.6,40.95 28.5,40.05 28.5,38.1 29.7,36.9 29.72,36.9 X3.13
OC1.3
  Top 0.3: X3.14 29.8,38.55 30.9,37.42 30.9,34.65 27.9,31.6 27.9,28 28.06,28.16 U2.12
  Bottom 0.15: X4.7 22.37,41.25 27.9,41.25 29.7,39.45 29.71,39.45 X3.14
OC1.4
  Top 0.3: X3.16 32.34,38.88 33.77,37.45 33.77,35.05 29.25,30.55 29.25,28 29.09,27.86 U2.11
  Bottom 0.15: X4.5 29.37,41.25 30.45,41.25 X3.16
OC1.5
  Top 0.3: X3.17 34.88,34.83 30.45,30.4 30.45,28 30.46,27.86 U2.10
  Bottom 0.15: X4.4 33.6,40.52 33.6,38.1 X3.17
OC1.6
  Top 0.3: X3.18 34.88,38.57 36.15,37.3 36.15,34.9 33.35,32.15 U3.16
  Bottom 0.15: X3.18 34.88,42.74 X4.3
OC1.7
  Top 0.3: U3.15 34.62,32.08 37.42,34.83 X3.19
  Bottom 0.15: X3.19 36,38.24 36,40.6 38.25,42.85 X4.2
OC2.0
  Top 0.3: X3.21 39.96,34.81 36,30.85 36,27.85 36.16,27.84 U3.14
  Bottom 0.15: X3.21 38.85,37.93 38.85,40.05 39.9,41.1 42.9,41.1 43.5,41.7 45.75,41.7 46.8,42.75 X5.10
OC2.1
  Top 0.3: X3.22 39.96,38.44 41.25,37.15 41.25,34.9 37.2,30.85 37.2,27.7 37.19,27.69 U3.13
  Bottom 0.15: X5.9 49.26,41.7 48,41.7 47.7,41.4 43.65,41.4 43.05,40.8 41.4,40.8 X3.22
OC2.2
  Top 0.3: X3.23 42.5,34.83 38.5,30.82 38.5,27.75 38.29,27.69 U3.12
  Bottom 0.15: X3.23 41.25,38.07 41.25,39.9 41.85,40.5 43.2,40.5 43.8,41.1 47.85,41.1 48.15,41.4 51.15,41.4 51.45,41.7 52.6,41.7 X5.8
OC2.3
  Top 0.3: X3.24 42.5,38.6 43.6,37.5 43.6,34.67 39.75,30.85 39.75,27.7 39.89,27.54 U3.11
  Bottom 0.15: X5.7 56.26,41.7 54.9,41.7 54.6,41.4 51.6,41.4 51.3,41.1 48.3,41.1 48,40.8 43.95,40.8 42.52,39.38 X3.24
OC2.4
  Top 0.3: X3.26 45.04,38.84 46.48,37.4 46.48,35.48 40.95,29.95 40.95,27.55 41.12,27.57 U3.10
  Bottom 0.15: X5.5 63.26,41.85 62.25,41.85 61.8,41.4 55.05,41.4 54.75,41.1 51.75,41.1 51.45,40.8 48.45,40.8 48.15,40.5 46.2,40.5 45.15,39.45 45.13,39.45 X3.26
OC2.5
  Top 0.3: X3.27 47.58,34.93 46.35,33.7 46.35,28.3 46.26,28.2 U4.16
  Bottom 0.15: X5.4 66.45,41.4 62.25,41.4 61.95,41.1 55.2,41.1 54.9,40.8 51.9,40.8 51.6,40.5 49.35,40.5 48.6,39.75 48.6,38.7 47.58,37.68 X3.27
OC2.6  (via drill 0.3)
  Top 0.15: 48.58,37.77 v48.6,37.8
  Top 0.3: X3.28 47.58,38.77 48.58,37.77 48.9,37.45 48.9,34.9 47.7,33.7 47.7,28.3 47.52,28.12 | 47.52,28.12 47.7,27.55 | U4.15 47.52,28.12
  Bottom 0.15: X5.3 69.66,41.1 62.4,41.1 62.1,40.8 55.35,40.8 55.05,40.5 54.75,40.5 53.92,39.67 53.92,38.92 53.25,38.25 51.75,38.25 51.3,37.8 v48.6,37.8
OC2.7
  Top 0.3: X3.29 50.12,34.92 48.9,33.7 48.9,28.15 48.87,28.12 U4.14
  Bottom 0.15: X5.2 72.86,40.8 62.55,40.8 62.25,40.5 57.3,40.5 56.48,39.67 56.48,38.98 55.42,37.92 51.98,37.92 50.85,36.8 50.3,36.8 X3.29
OC3.0
  Top 0.3: X3.31 52.66,34.91 50.25,32.5 50.25,28.3 50.07,28.12 U4.13
OC3.1
  Top 0.3: X3.32 52.66,38.49 54,37.15 54,34.9 51.45,32.35 51.45,28.3 51.33,28.12 U4.12
OC3.2
  Top 0.3: X3.33 55.2,34.9 52.8,32.35 52.8,28.23 52.6,28.18 U4.11
OC3.3
  Top 0.3: X3.34 55.2,38.95 56.33,37.83 56.33,34.83 54.08,32.58 54.08,28.3 54,28.23 54.02,28.05 U4.10
OC3.4
  Top 0.3: X3.36 57.74,38.81 59.17,37.38 59.17,35.12 56.85,32.8 56.85,28 57.05,28.1 U5.16
OC3.5
  Top 0.3: X3.37 60.28,34.88 58.2,32.8 58.2,28.3 58.33,28.43 U5.15
OC3.6
  Top 0.3: X3.38 60.28,38.67 61.5,37.45 61.5,34.95 59.42,32.88 59.42,28.05 59.6,28.18 59.45,28.02 U5.14
OC3.7
  Top 0.3: X3.39 62.82,34.87 60.75,32.8 60.75,28 60.56,27.82 U5.13
OC4.0
  Top 0.3: X3.41 65.36,34.86 61.92,31.43 61.92,28 62.09,28.15 U5.12
OC4.1
  Top 0.3: X3.42 65.36,38.69 66.75,37.3 66.75,34.9 63.3,31.45 63.3,28 63.26,27.95 U5.11
OC4.2
  Top 0.3: X3.43 67.9,34.92 64.53,31.55 64.53,27.93 | U5.10 64.53,27.93 | 64.53,27.93 64.55,27.6
OC4.3
  Top 0.3: X3.44 67.9,38.55 69,37.45 69,34.75 67.5,33.25 67.5,28.38 67.41,28.17 U6.16
OC4.4
  Top 0.3: X3.46 70.44,38.86 71.85,37.45 71.85,34.98 68.7,31.82 68.7,28.45 68.67,28.12 U6.15
OC4.5
  Top 0.3: X3.47 72.98,34.83 69.95,31.8 69.95,27.8 70.09,27.64 U6.14
OC4.6
  Top 0.3: X3.48 72.98,38.57 74.25,37.3 74.25,34.83 71.2,31.77 71.2,27.82 71.22,27.51 U6.13
OC4.7
  Top 0.3: X3.49 75.52,34.9 72.42,31.8 72.42,27.95 72.48,27.89 U6.12
VDRV  (via drill 0.3)
  Top 0.15: F2.1 81.31,26.63 81.15,26.77 81.01,26.61 F1.1
  other vias: 21.25,29.52 21.25,26.12 31.75,26.12 31.75,29.52 42.23,29.52 42.23,26.1 55.3,29.52 55.27,26.1 65.8,26.1 65.8,29.52 76.3,29.52 76.3,26.1 10.15,25.98 44.38,25.98 78.22,25.95
  pour Top (isolate 0.35): 0,46.75 0,25.75 83.4,25.75 83.4,34.15 81,34.15 81,46.75
  pour Bottom (isolate 0.35, rank 2): 0,25.75 0,46.75 80.1,46.75 80.1,31.75 83.4,31.75 83.4,25.75
VIN
  Top 1.3: JP1.1 84.77,11.54 77.7,11.55 69,2.85 X1.49
VSUPP
  Top 1.3: JP1.2 85.62,14.13 81.15,18.6 81.15,21.9 81.16,21.89 F2.2 81.16,22.17 81.15,22.18 F1.2

### Text on the board
tStop: sautter.com